# Altium schematic sheet Main.SchDoc: USB Board
size A3
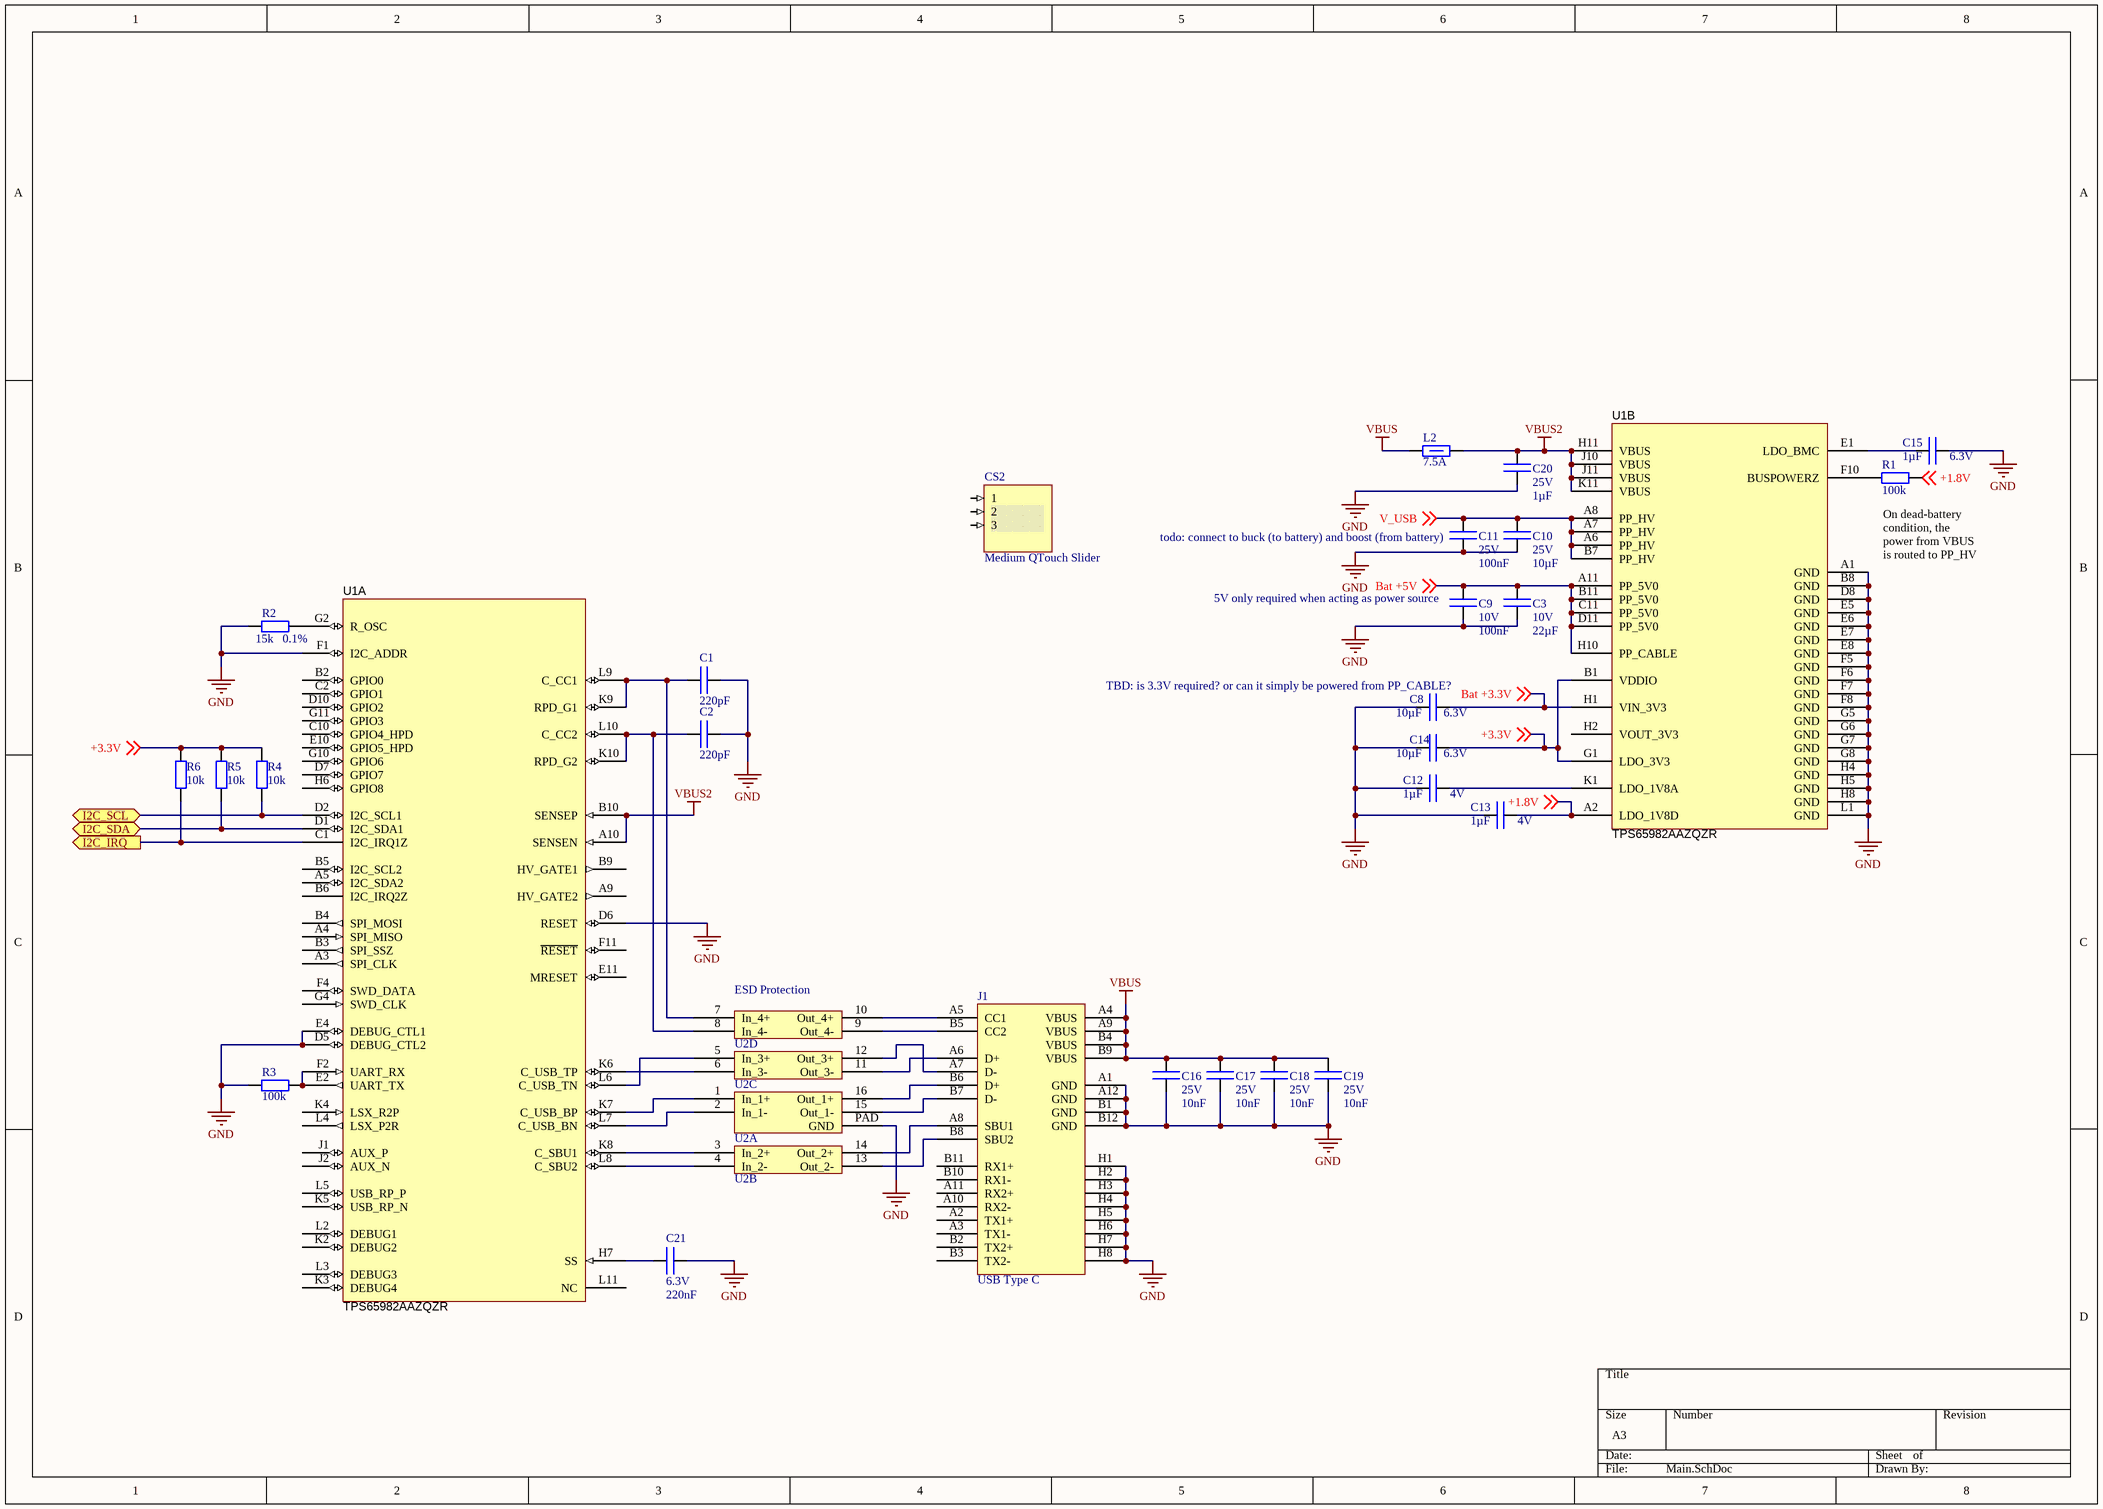
[diagram p0: Main.SchDoc]

## Parts
C1  Capacity: 220pF  [0201 (C)]  (hidden comment: Cap 220pF)
C2  Capacity: 220pF  [0201 (C)]  (hidden comment: Cap 220pF)
C3  VOLTAGE: 10V  CAPACITY: 22µF  [0603 (C)]  (hidden comment: Cap 22µF)
C8  Voltage: 6.3V  Capacity: 10µF  [0402 (C)]  (hidden comment: Cap 10µF)
C9  Voltage: 10V  Capacity: 100nF  [0201 (C)]  (hidden comment: Cap 100nF)
C10  Voltage: 25V  Capacity: 10µF  [0603 (C)]  (hidden comment: Cap 10µF)
C11  Voltage: 25V  Capacity: 100nF  [0201 (C)]  (hidden comment: Cap 100nF)
C12  Voltage: 4V  Capacity: 1µF  [0201 (C)]  (hidden comment: Cap 1µF)
C13  Voltage: 4V  Capacity: 1µF  [0201 (C)]  (hidden comment: Cap 1µF)
C14  Voltage: 6.3V  Capacity: 10µF  [0402 (C)]  (hidden comment: Cap 10µF)
C15  Voltage: 6.3V  Capacity: 1µF  [0201 (C)]  (hidden comment: Cap 1µF)
C16  Voltage: 25V  Capacity: 10nF  [0201 (C)]  (hidden comment: Cap 10nF)
C17  Voltage: 25V  Capacity: 10nF  [0201 (C)]  (hidden comment: Cap 10nF)
C18  Voltage: 25V  Capacity: 10nF  [0201 (C)]  (hidden comment: Cap 10nF)
C19  Voltage: 25V  Capacity: 10nF  [0201 (C)]  (hidden comment: Cap 10nF)
C20  Voltage: 25V  Capacity: 1µF  [0402 (C)]  (hidden comment: Cap 1µF)
C21  Voltage: 6.3V  Capacity: 220nF  [0201 (C)]  (hidden comment: Cap 220nF)
CS2  Medium QTouch Slider  (no BOM)
J1  USB Type C  [DX07S024JJ2]
L2  Current: 7.5A  [0603 (L)]  (hidden comment: FBMJ1608HS220NTR)
R1  value 100k  [0201 (R)]  (hidden comment: Res 100k)
R2  value 15k  Tolerance: 0.1%  [0201 (R)]  (hidden comment: Res 15k)
R3  value 100k  [0201 (R)]  (hidden comment: Res 100k)
R4  value 10k  [0201 (R)]  (hidden comment: Res 10k)
R5  value 10k  [0201 (R)]  (hidden comment: Res 10k)
R6  value 10k  [0201 (R)]  (hidden comment: Res 10k)
U1  TPS65982AAZQZR  [ZQZ0096A_Oval]  (parts A,B of 2)
U2  CM1235  [WDFN-16 (4mmx1.7mm)]  (value not drawn)  (parts A,B,C,D of 4)

## Ports
I2C_IRQ (out), I2C_SCL, I2C_SDA

## Nets
GND: C1.1 C2.1 C3.1 C8.1 C9.2 C10.1 C11.1 C12.1 C13.1 C14.1 C15.2 C16.1 C17.1 C18.1 C19.1 C20.1 C21.1 J1.A1(GND) J1.A12(GND) J1.B1(GND) J1.B12(GND) J1.H1 J1.H2 J1.H3 J1.H4 J1.H5 J1.H6 J1.H7 J1.H8 R2.2 R3.1 U1.A1(GND) U1.B8(GND) U1.D5(DEBUG_CTL2) U1.D6(RESET) U1.D8(GND) U1.E4(DEBUG_CTL1) U1.E5(GND) U1.E6(GND) U1.E7(GND) U1.E8(GND) U1.F1(I2C_ADDR) U1.F5(GND) U1.F6(GND) U1.F7(GND) U1.F8(GND) U1.G5(GND) U1.G6(GND) U1.G7(GND) U1.G8(GND) U1.H4(GND) U1.H5(GND) U1.H8(GND) U1.L1(GND) U2.PAD(GND)
VBUS: C16.2 C17.2 C18.2 C19.2 J1.A4(VBUS) J1.A9(VBUS) J1.B4(VBUS) J1.B9(VBUS) L2.1
VBUS2: C20.2 L2.2 U1.A10(SENSEN) U1.B10(SENSEP) U1.H11(VBUS) U1.J10(VBUS) U1.J11(VBUS) U1.K11(VBUS)
+1.8V: C13.2 R1.1 U1.A2(LDO_1V8D) ; off-sheet +1.8V
+3.3V: C14.2 R4.2 R5.2 R6.2 U1.B1(VDDIO) U1.G1(LDO_3V3) ; off-sheet +3.3V
Bat +3.3V: C8.2 U1.H1(VIN_3V3) ; off-sheet Bat +3.3V
Bat +5V: C3.2 C9.1 U1.A11(PP_5V0) U1.B11(PP_5V0) U1.C11(PP_5V0) U1.D11(PP_5V0) U1.H10(PP_CABLE) ; off-sheet Bat +5V
I2C_IRQ: R6.1 U1.C1(I2C_IRQ1Z) ; port I2C_IRQ
I2C_SCL: R4.1 U1.D2(I2C_SCL1) ; port I2C_SCL
I2C_SDA: R5.1 U1.D1(I2C_SDA1) ; port I2C_SDA
V_USB: C10.2 C11.2 U1.A6(PP_HV) U1.A7(PP_HV) U1.A8(PP_HV) U1.B7(PP_HV) ; off-sheet V_USB
NetC1_2: C1.2 U1.K9(RPD_G1) U1.L9(C_CC1) U2.7(In_4+)
NetC2_2: C2.2 U1.K10(RPD_G2) U1.L10(C_CC2) U2.8(In_4-)
NetC12_2: C12.2 U1.K1(LDO_1V8A)
NetC15_1: C15.1 U1.E1(LDO_BMC)
NetC21_2: C21.2 U1.H7(SS)
NetJ1_A5: J1.A5(CC1) U2.10(Out_4+)
NetJ1_A6: J1.A6(D+) U2.11(Out_3-)
NetJ1_A7: J1.A7(D-) U2.12(Out_3+)
NetJ1_A8: J1.A8(SBU1) U2.14(Out_2+)
NetJ1_B5: J1.B5(CC2) U2.9(Out_4-)
NetJ1_B6: J1.B6(D+) U2.16(Out_1+)
NetJ1_B7: J1.B7(D-) U2.15(Out_1-)
NetJ1_B8: J1.B8(SBU2) U2.13(Out_2-)
NetR1_2: R1.2 U1.F10(BUSPOWERZ)
NetR2_1: R2.1 U1.G2(R_OSC)
NetR3_2: R3.2 U1.E2(UART_TX) U1.F2(UART_RX)
NetU1_K6: U1.K6(C_USB_TP) U2.6(In_3-)
NetU1_K7: U1.K7(C_USB_BP) U2.1(In_1+)
NetU1_K8: U1.K8(C_SBU1) U2.3(In_2+)
NetU1_L6: U1.L6(C_USB_TN) U2.5(In_3+)
NetU1_L7: U1.L7(C_USB_BN) U2.2(In_1-)
NetU1_L8: U1.L8(C_SBU2) U2.4(In_2-)

Not connected (* = marked no-connect by the designer): CS2 1 2 3; J1 A2(TX1+) A3(TX1-) A10(RX2-) A11(RX2+) B2(TX2+) B3(TX2-) B10(RX1-) B11(RX1+); U1 A3(SPI_CLK) A4(SPI_MISO) A5(I2C_SDA2) A9(HV_GATE2) B2(GPIO0) B3(SPI_SSZ) B4(SPI_MOSI) B5(I2C_SCL2) B6(I2C_IRQ2Z) B9(HV_GATE1) C2(GPIO1) C10(GPIO4_HPD) D7(GPIO7) D10(GPIO2) E10(GPIO5_HPD) E11(MRESET) F4(SWD_DATA) F11(~{RESET}) G4(SWD_CLK) G10(GPIO6) G11(GPIO3) H2(VOUT_3V3) H6(GPIO8) J1(AUX_P) J2(AUX_N) K2(DEBUG2) K3(DEBUG4) K4(LSX_R2P) K5(USB_RP_N) L2(DEBUG1) L3(DEBUG3) L4(LSX_P2R) L5(USB_RP_P) L11(NC)

## Notes on the sheet
- todo: connect to buck (to battery) and boost (from battery)
- (near R1) On dead-battery condition, the power from VBUS is routed to PP_HV
- (near C9) 5V only required when acting as power source
- (near C8) TBD: is 3.3V required? or can it simply be powered from PP_CABLE?
- (near U2) ESD Protection

## Library data of the parts
C1 C2 = Cap 220pF: Ceramic Capacitor 220pF; Voltage: 50V; Digi-Key: ?
C3 = Cap 22µF: Ceramic Capacitor 22µF
C8 C10 C14 = Cap 10µF: Ceramic Capacitor 10µF
C9 C11 = Cap 100nF: Ceramic Capacitor 100nF
C12 C13 C15 C20 = Cap 1µF: Ceramic Capacitor 1µF
C16-C19 = Cap 10nF: Ceramic Capacitor 10nF
C21 = Cap 220nF: Ceramic Capacitor 220nF
CS2 = MediumQTouchSlider: ConfiguratorName: ATMEL_TOUCH; ConfigurationParameters: {}__sensorid[4]{}width[50]{}height[4]{}gapthickness[0.3]{}
J1 = DX07: USB Type C Receptacle; Supplier 1: Digi-Key; Supplier Part Number 1: 670-2794-1-ND
L2 = FBMJ1608HS220NTR: Ferrit Bead 7.5A; DC Resistance: 4mOhm (max); Impedance @ 100MHz: 22 Ohm; Digi-Key: 587-3253-1-ND
R1 R3 = Res 100k: Resistor 100k; Published: 8-Jun-2000; LatestRevisionDate: 17-Jul-2002; LatestRevisionNote: Re-released for DXP Platform.; PackageReference: AXIAL-0.4; Publisher: Altium Limited; PackageDescription: Axial Device, Thru-Hole; 2 Leads; 0.4 in Pin Spacing
R2 = Res 15k: Resistor 15k
R4-R6 = Res 10k: Resistor 10k; Published: 8-Jun-2000; LatestRevisionDate: 17-Jul-2002; LatestRevisionNote: Re-released for DXP Platform.; PackageReference: AXIAL-0.4; Publisher: Altium Limited; PackageDescription: Axial Device, Thru-Hole; 2 Leads; 0.4 in Pin Spacing; Supplier 1: Digi-Key; Supplier Part Number 1: RMCF0805FT10K0CT-ND
U1 = TPS65982AAZQZR: TPS65982 Preview Specification, ZQZ0096A; Manufacturer: Texas Instruments; SymbolCreator: Altium; CompType: IC; U/M: EA; SymbolVersion: 2015-01-26; PartNumber: TPS65982AAZQZR; PackageReference: ZQZ0096A; MountType: SMT; ComponentLink1Description: Datasheet Link; ComponentLink1URL: https://sps06.itg.ti.com/sites/KMS/crossdivteams/altium/docs/ComponentDatasheets/TPS65982_specification_0p94_Mechanical-ONLY.pdf; Publisher: Texas Instruments; LatestRevisionDate: 2015-03-08; Alternate Manufacturer: Texas Instruments
U2 = CM1235: ESD Protection; Max Voltage: 5.5V; Supplier 1: Digi-Key; Supplier Part Number 1: CM1235-08DEOSCT-ND